# EAGLE design switch-backpack (EAGLE 7.7.0)
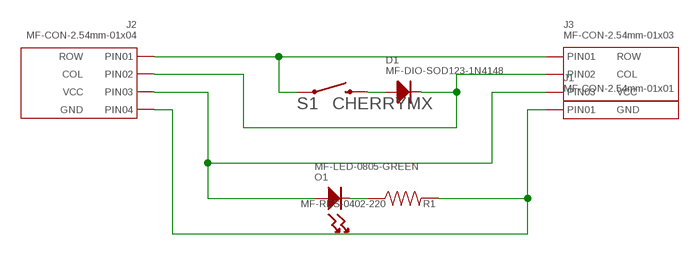
[diagram p0: schematic, sheet 1]

## Parts
D1  MF-DIO-SOD123-1N4148  DIODES_1N4148_SOD-123  [SOD-123]
J1  MF-CON-2.54mm-01x01  CON_01X01_PTH_2.54MM  [PTH_2.54MM_01X01]
J2  MF-CON-2.54mm-01x04  CON_01X04_PTH_2.54MM  [PTH_2.54MM_01X04]
J3  MF-CON-2.54mm-01x03  CON_01X03_PTH_2.54MM  [PTH_2.54MM_01X03]
O1  MF-LED-0805-GREEN  LED_SINGLE-0805  [LED0805]
R1  MF-RES-0402-220  RESISTOR_0402  [R0402]
S1  CHERRYMX  SWITCH-MOMENTARY-2CHERRYMX  [CHERRYMX]

## Nets
GND [power]: J1.P$1(PIN1) J2.P$4(PIN4) R1.P$2
N$1: J2.P$1(PIN1) J3.P$1(PIN1) S1.P$1
N$2: D1.ANODE S1.P$2
N$3: D1.CATHODE J2.P$2(PIN2) J3.P$2(PIN2)
N$5: O1.CATHODE R1.P$1
VCC [power]: J2.P$3(PIN3) J3.P$3(PIN3) O1.ANODE

## Library data of the parts
D1 = MF_Discrete_Semiconductor:DIODES: Library: MF_Discrete_Semiconductor Description: Device for Single Packaged Diodes.; HOUSEPART: YES; MPN: MF-DIO-SOD123-1N4148; POPULATE: 1; URL: https://factory.macrofab.com/part/MF-DIO-SOD123-1N4148
J1 = MF_Connectors:CON_01X01: Library: MF_Connectors Description: Header Connector with 01 Positions and 01 Rows. Use the LABEL Attribute to label the pin on the schematic and PCB. You can remove the attributes on the PCB by using the SMASH function on the part and then deleting the text.; HOUSEPART: YES; LABEL01: GND; MPN: MF-CON-2.54mm-01x01; POPULATE: 1; URL: https://factory.macrofab.com/part/MF-CON-2.54mm-01x01
J2 = MF_Connectors:CON_01X04: Library: MF_Connectors Description: Header Connector with 04 Positions and 01 Rows. Use the LABEL Attribute to label the pin on the schematic and PCB. You can remove the attributes on the PCB by using the SMASH function on the part and then deleting the text.; HOUSEPART: YES; LABEL01: ROW; LABEL02: COL; LABEL03: VCC; LABEL04: GND; MPN: MF-CON-2.54mm-01x04; POPULATE: 1; URL: https://factory.macrofab.com/part/MF-CON-2.54mm-01x04
J3 = MF_Connectors:CON_01X03: Library: MF_Connectors Description: Header Connector with 03 Positions and 01 Rows. Use the LABEL Attribute to label the pin on the schematic and PCB. You can remove the attributes on the PCB by using the SMASH function on the part and then deleting the text.; HOUSEPART: YES; LABEL01: ROW; LABEL02: COL; LABEL03: VCC; MPN: MF-CON-2.54mm-01x03; POPULATE: 1; URL: https://factory.macrofab.com/part/MF-CON-2.54mm-01x03
O1 = MF_LEDs:LED_SINGLE: Library: MF_LEDs Description: Device for Single LED Packages. Manufacture part number (MFG#) can be added via Attributes.; HOUSEPART: NO; POPULATE: 1
R1 = MF_Passives:RESISTOR: Library: MF_Passives Description: Device for Resistors. Manufacture part number (MPN), Voltage, Tolerance, and Wattage Rating can be added via Attributes. Check https://factory.macrofab.com/parts for the house parts list.; POPULATE: 1
S1 = sonik:SWITCH-MOMENTARY-2: Various NO switches- pushbuttons, reed, etc

## Net classes
1 power: width 0.406 mm

## Board
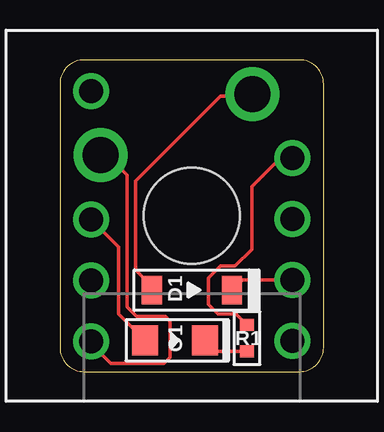
[diagram p1: board, top side]
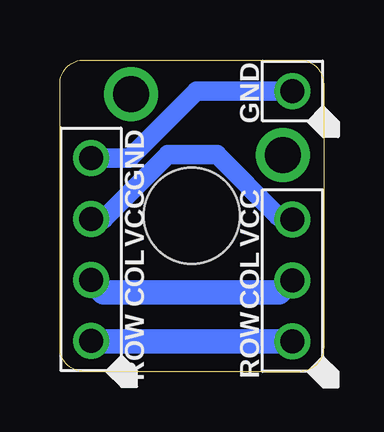
[diagram p2: board, bottom side, seen from below]

Size 11 x 13 mm. Coordinates in mm from the lower left corner, seen from the top.
Outline: 1,0 10,0 arc90 11,1 11,12 arc90 10,13 1,13 arc90 0,12 0,1 arc90 1,0
Copper layers (1*16): Top 0.035mm / dielectric 1.5mm / Bottom 0.035mm
Design rules "MF_Standard_2_Layer": minimum track width 5mil, minimum drill 12mil, track to track 5mil, track to pad 5mil, pad to pad 5mil, via to via 5mil, smd to smd 0mil, copper to edge 10mil, drill to drill 10mil, minimum pad ring 6mil, minimum via ring 6mil, stop-mask expansion 2mil, vias tented up to drill 25mil, thermal gap 10mil

### Footprints (pad centres in the part's own frame; a part is rotated, then mirrored left to right if it is on the bottom)
SOD-123 = smd 0.85 x 1.2: ANODE 1.675,0; CATHODE -1.675,0
PTH_2.54MM_01X01 = drill 1: P$1 0,0
PTH_2.54MM_01X04 = drill 1: P$1 -3.81,0; P$2 -1.27,0; P$3 1.27,0; P$4 3.81,0
PTH_2.54MM_01X03 = drill 1: P$1 -2.54,0; P$2 0,0; P$3 2.54,0
LED0805 = smd 1.1 x 1.25: ANODE 1.25,0; CATHODE -1.25,0
R0402 = smd 0.5 x 0.6: P$1 -0.55,0; P$2 0.55,0
CHERRYMX = drill 1.499: P$1 -3.81,2.54; P$2 2.54,5.08 | hole 3.988: 0,0

### Placement (x,y rotation side)
D1  5.5,3.4 180 top
J1  1.3,11.7 90 bottom
J2  9.7,5.1 90 bottom
J3  1.3,3.8 90 bottom
O1  4.8,1.3 180 top
R1  7.8,1.4 90 top
S1  5.5,6.5 0 top

### Tracks (layer width: path | path; a pad name or v marks a point on that pad's centre or on a via)
GND
  Top 0.152: R1.P$2 7.35,2.4 6.6,2.4 6.2,2.8 6.2,3.9 6.7,4.4 7.3,4.4 8,5.1 8,7.71 9.2,8.91 J2.P$4
  Bottom 0.813: J2.P$4 8.09,8.91 5.3,11.7 J1.P$1
N$1
  Top 0.152: S1.P$1 1.69,9.31 2.8,8.2 2.8,2.7 3.2,2.3 4.4,2.3 4.6,2.1 4.6,0.6 4.35,0.35 2.11,0.35 1.3,1.16 J3.P$1
  Bottom 1.016: J2.P$1 9.67,1.26 J3.P$1
N$2
  Top 0.152: D1.ANODE 3.83,3.58 3.15,4.25 3.15,7.95 6.7,11.5 7.96,11.5 S1.P$2
N$3
  Top 0.152: D1.CATHODE 7.61,3.83 J2.P$2
  Bottom 1.016: J3.P$2 1.33,3.83 1.86,3.3 9.17,3.3 J2.P$2
N$5
  Top 0.152: O1.CATHODE 6.5,0.85 R1.P$1
VCC
  Top 0.152: O1.ANODE 2.45,2.4 2.45,5.19 J3.P$3
  Bottom 0.61: 1.9,6.5 1.46,6.5 J3.P$3 | 9.18,6.37 J2.P$3
  Bottom 0.813: 1.9,6.5 4.45,9.05 6.5,9.05 9.18,6.37